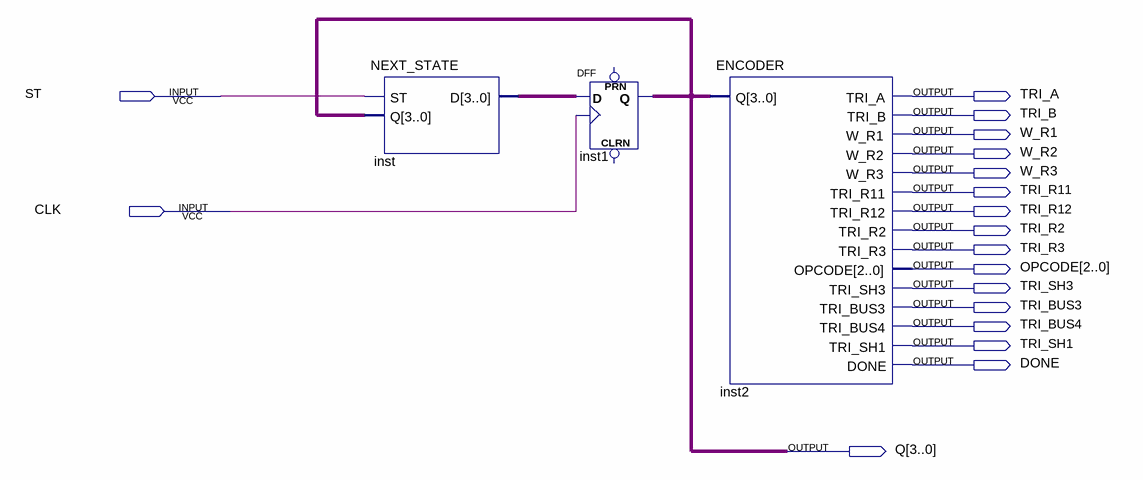
[diagram p0: schematic sheet]
// Quartus schematic CONTROLLER.bdf as structural Verilog: 3 symbols, 18 pins
module CONTROLLER (
  input  ST,
  input  CLK,
  output TRI_A,
  output TRI_B,
  output W_R1,
  output W_R2,
  output W_R3,
  output TRI_R11,
  output TRI_R12,
  output TRI_R2,
  output TRI_R3,
  output [2:0] OPCODE,
  output TRI_SH3,
  output TRI_BUS3,
  output TRI_BUS4,
  output TRI_SH1,
  output DONE,
  output [3:0] Q
);

  wire [3:0] inst_d;

  NEXT_STATE inst (.ST(ST), .Q(Q), .D(inst_d));
  DFF inst1[3:0] (.CLK(CLK), .D(inst_d), .Q(Q));  // open: CLRN, PRN
  ENCODER inst2 (
    .Q(Q), .TRI_A(TRI_A), .TRI_B(TRI_B), .W_R1(W_R1), .W_R2(W_R2), .W_R3(W_R3), .TRI_R11(TRI_R11),
    .TRI_R12(TRI_R12), .TRI_R2(TRI_R2), .TRI_R3(TRI_R3), .OPCODE(OPCODE), .TRI_SH3(TRI_SH3),
    .TRI_BUS3(TRI_BUS3), .TRI_BUS4(TRI_BUS4), .TRI_SH1(TRI_SH1), .DONE(DONE));
endmodule
